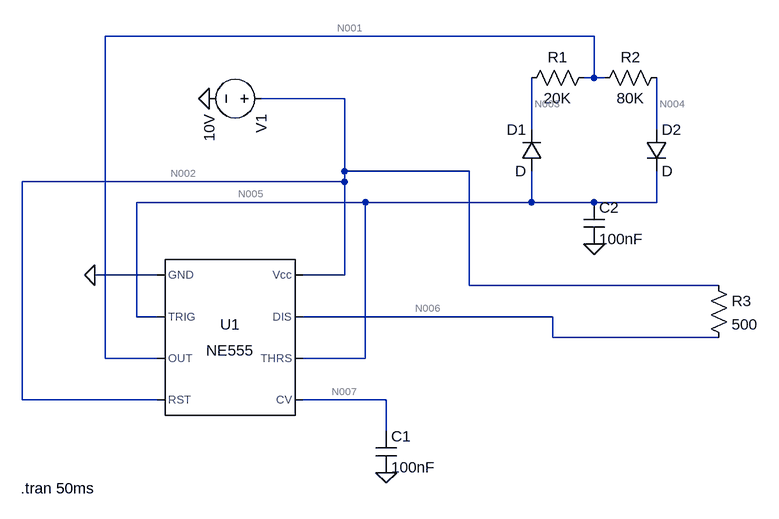
[diagram p0: schematic Simulation.asc]
Simulation.asc, the LTspice schematic file:
Version 4
SHEET 1 1028 680
WIRE 768 -368 16 -368
WIRE 768 -304 768 -368
WIRE 768 -304 752 -304
WIRE 784 -304 768 -304
WIRE 384 -272 256 -272
WIRE 672 -224 672 -304
WIRE 864 -224 864 -304
WIRE 384 -160 384 -272
WIRE 576 -160 384 -160
WIRE 384 -144 384 -160
WIRE 384 -144 -112 -144
WIRE 416 -112 64 -112
WIRE 672 -112 672 -160
WIRE 672 -112 416 -112
WIRE 768 -112 672 -112
WIRE 864 -112 864 -160
WIRE 864 -112 768 -112
WIRE 96 0 0 0
WIRE 384 0 384 -144
WIRE 384 0 320 0
WIRE 576 16 576 -160
WIRE 960 16 576 16
WIRE 64 64 64 -112
WIRE 96 64 64 64
WIRE 704 64 320 64
WIRE 704 96 704 64
WIRE 960 96 704 96
WIRE 16 128 16 -368
WIRE 96 128 16 128
WIRE 416 128 416 -112
WIRE 416 128 320 128
WIRE -112 192 -112 -144
WIRE 96 192 -112 192
WIRE 448 192 320 192
WIRE 448 240 448 192
FLAG 0 0 0
FLAG 768 -48 0
FLAG 448 304 0
FLAG 176 -272 0
SYMBOL Misc\\NE555 208 96 R0
SYMATTR InstName U1
SYMBOL voltage 272 -272 R90
WINDOW 123 0 0 Left 2
WINDOW 39 0 0 Left 2
SYMATTR InstName V1
SYMATTR Value 10V
SYMBOL diode 688 -160 R180
WINDOW 0 24 64 Left 2
WINDOW 3 24 0 Left 2
SYMATTR InstName D1
SYMBOL diode 848 -224 R0
SYMATTR InstName D2
SYMBOL res 768 -320 R90
WINDOW 0 0 56 VBottom 2
WINDOW 3 32 56 VTop 2
SYMATTR InstName R1
SYMATTR Value 20K
SYMBOL res 880 -320 R90
WINDOW 0 0 56 VBottom 2
WINDOW 3 32 56 VTop 2
SYMATTR InstName R2
SYMATTR Value 80K
SYMBOL cap 432 240 R0
SYMATTR InstName C1
SYMATTR Value 100nF
SYMBOL cap 752 -112 R0
SYMATTR InstName C2
SYMATTR Value 100nF
SYMBOL res 944 0 R0
SYMATTR InstName R3
SYMATTR Value 500
TEXT -114 328 Left 2 !.tran 50ms

The netlist it stands for:
* Simulation.asc
XU1 0 N005 N001 N002 N007 N005 N006 N002 NE555  ; pins GND TRIG OUT RST CV THRS DIS Vcc
V1 N002 0 10V
D1 N005 N003 D
D2 N004 N005 D
R1 N001 N003 20K
R2 N004 N001 80K
C1 N007 0 100nF
C2 N005 0 100nF
R3 N002 N006 500
.model D D
.lib standard.dio
.tran 50ms
.lib NE555.sub
.backanno
.end

* Results of the author's LTspice run, read from the files saved beside the schematic
* Operating Point, zero values left out:
*   V(n005) = 9.624 V
*   V(n007) = 6.667 V
*   V(n002) = 10 V
*   V(n006) = 10 V
*   V(n001) = 10 V
*   V(n003) = 10 V
*   V(n004) = 9.998 V
*   I(D2) = 19.25 nA
*   I(R3) = 13.34 nA
*   I(R2) = -19.25 nA
*   I(V1) = -3.233 mA
*   Ix(u1:1) = -3.233 mA
*   Ix(u1:2) = 9.624 nA
*   Ix(u1:3) = -19.25 nA
*   Ix(u1:4) = 56 µA
*   Ix(u1:6) = 9.624 nA
*   Ix(u1:7) = 13.34 nA
*   Ix(u1:8) = 3.177 mA
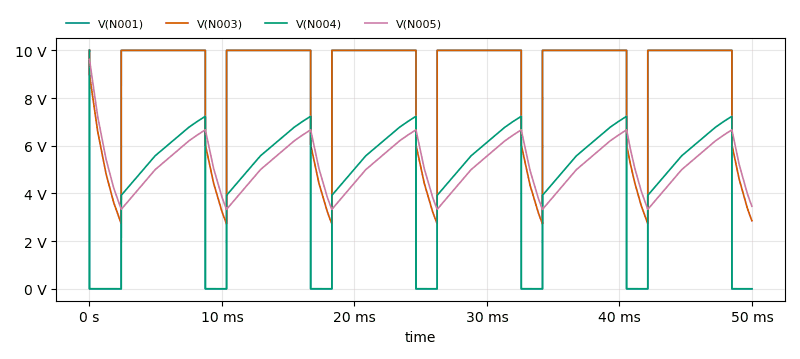
[diagram p1: Transient Analysis of Simulation.asc, plotted from the saved traces]
* Transient Analysis, 1 run:
*   V(N001): min 878.3 µV, max 10 V, average 7.617 V, rms 8.727 V, last 916.6 µV
*   V(N003): min 2.729 V, max 10 V, average 8.671 V, rms 9.015 V, last 2.856 V
*   V(N004): min 878.6 µV, max 9.998 V, average 4.391 V, rms 5.122 V, last 916.9 µV
*   V(N005): min 3.332 V, max 9.624 V, average 5.151 V, rms 5.284 V, last 3.461 V